# EAGLE design FourRandomLamps_RevB (EAGLE 9.5.0)
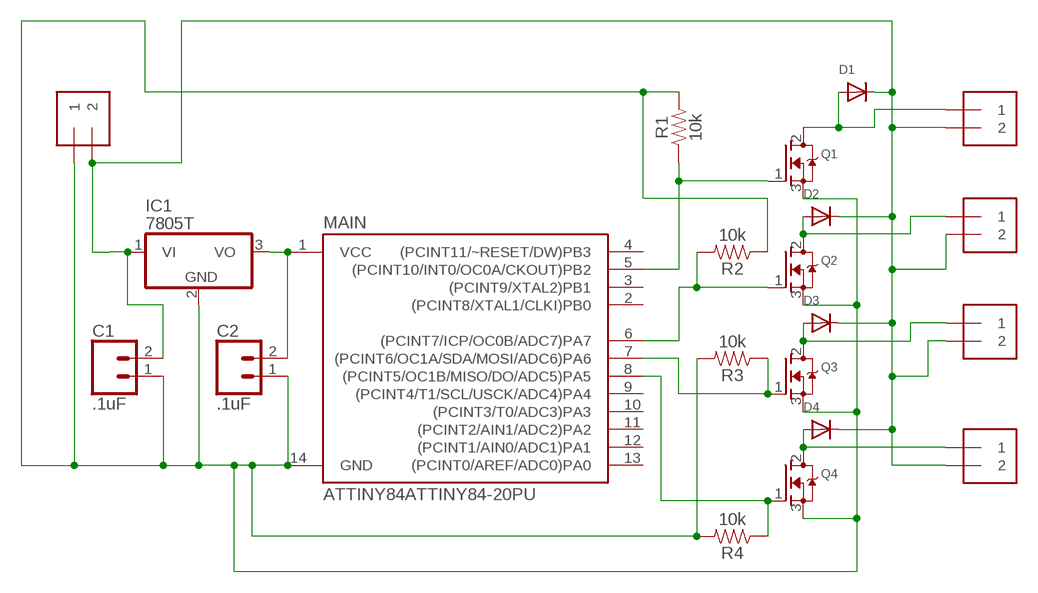
[diagram p0: schematic, sheet 1]

## Parts
12VDC  1X2-3.5MM  [1X2-3.5MM]
C1  .1uF  CONN_02LOCK  [1X02_LOCK]
C2  .1uF  CONN_02LOCK  [1X02_LOCK]
D1  DIODEDO-1N4148  [DO-1N4148]
D2  DIODEDO-1N4148  [DO-1N4148]
D3  DIODEDO-1N4148  [DO-1N4148]
D4  DIODEDO-1N4148  [DO-1N4148]
IC1  7805T  [TO220H]
LAMP1  1X2-3.5MM  [1X2-3.5MM]
LAMP2  1X2-3.5MM  [1X2-3.5MM]
LAMP3  1X2-3.5MM  [1X2-3.5MM]
LAMP4  1X2-3.5MM  [1X2-3.5MM]
MAIN  ATTINY84ATTINY84-20PU  [DIP14]
Q1  MOSFET-NGDS_TO220V  [TO220V]
Q2  MOSFET-NGDS_TO220V  [TO220V]
Q3  MOSFET-NGDS_TO220V  [TO220V]
Q4  MOSFET-NGDS_TO220V  [TO220V]
R1  10k  10KOHM-HORIZ-1/4W-5%  [AXIAL-0.3]
R2  10k  10KOHM-HORIZ-1/4W-5%  [AXIAL-0.3]
R3  10k  10KOHM-HORIZ-1/4W-5%  [AXIAL-0.3]
R4  10k  10KOHM-HORIZ-1/4W-5%  [AXIAL-0.3]

## Nets
N$1: C2.2 IC1.3(VO) MAIN.1(VCC)
N$2: 12VDC.2 C1.2 D1.C D2.C D3.C D4.C IC1.1(VI) LAMP1.2 LAMP2.2 LAMP3.2 LAMP4.2
N$3: MAIN.5((PCINT10/INT0/OC0A/CKOUT)PB2) Q1.1(G) R1.P$1
N$4: MAIN.6((PCINT7/ICP/OC0B/ADC7)PA7) Q2.1(G) R2.P$2
N$5: MAIN.7((PCINT6/OC1A/SDA/MOSI/ADC6)PA6) Q3.1(G) R3.P$1
N$6: MAIN.8((PCINT5/OC1B/MISO/DO/ADC5)PA5) Q4.1(G) R4.P$1
N$7: 12VDC.1 C1.1 C2.1 IC1.2(GND) MAIN.14(GND) Q1.3(S) Q2.3(S) Q3.3(S) Q4.3(S) R1.P$2 R2.P$1 R3.P$2 R4.P$2
N$9: D1.A LAMP1.1 Q1.2(D)
N$10: D2.A LAMP2.1 Q2.2(D)
N$11: D3.A LAMP3.1 Q3.2(D)
N$13: D4.A LAMP4.1 Q4.2(D)
Unconnected: MAIN.2((PCINT8/XTAL1/CLKI)PB0) MAIN.3((PCINT9/XTAL2)PB1) MAIN.4((PCINT11/~RESET/DW)PB3) MAIN.9((PCINT4/T1/SCL/USCK/ADC4)PA4) MAIN.10((PCINT3/T0/ADC3)PA3) MAIN.11((PCINT2/AIN1/ADC2)PA2) MAIN.12((PCINT1/AIN0/ADC1)PA1) MAIN.13((PCINT0/AREF/ADC0)PA0)

## Library data of the parts
12VDC LAMP1-LAMP4 = adafruit:1X2: 3.5mm Terminal block http://www.ladyada.net/library/pcb/eaglelibrary.html
C1 C2 = SparkFun-Connectors:CONN_02: Multi connection point. Often used as Generic Header-pin footprint for 0.1 inch spaced/style header connections On any of the 0.1 inch spaced packages, you can populate with these: Break Away Headers - Straight <https://www.sparkfun.com/products/116> (PRT-00116) Break Away Male Headers - Right Angle <https://www.sparkfun.com/products/553> (PRT-00553) Female Headers <https://www.sparkfun.com/products/115> (PRT-00115) Break Away Headers - Machine Pin <https://www.sparkfun.com/products/117> (PRT-00117) Break Away Female Headers - Swiss Machine Pin <https://www.sparkfun.com/products/743> (PRT-00743) For SCREWTERMINALS and SPRING TERMINALS visit here: Screw Terimnals on SparkFun.com <https://www.sparkfun.com/search/results?term=Screw+Terminals> (5mm/3.5mm/2.54mm spacing) This device is also useful as a general connection point to wire up your design to another part of your project. Our various solder wires solder well into these plated through hole pads. Hook-Up Wire - Assortment (Stranded, 22 AWG) <https://www.sparkfun.com/products/11375> (PRT-11375) Hook-Up Wire - Assortment (Solid Core, 22 AWG) <https://www.sparkfun.com/products/11367> (PRT-11367) View the entire wire category on our website here <https://www.sparkfun.com/categories/141> Special notes: Molex polarized connector foot print use with: PRT-08233 with associated crimp pins and housings. 2.54_SCREWTERM for use with PRT-10571. 3.5mm Screw Terminal footprints for PRT-08084 5mm Screw Terminal footprints for use with PRT-08432
D1-D4 = adafruit:DIODE: Diode SMADIODE - SMA Surface Mount Package 20V 1A Schottky Diode Digikey: 641-1014-6-ND DO-1N4148 - Through Hole Small Current Diode SOD-123 20V 1 A (.5mV Vf) Schottky Diode - Digikey: MBRX120TPMSCT-ND SOD-323 10V 570mA (.38mV Vf, 3ns) Schottky Diode - Digikey: ZLLS410CT-ND SOD-523 30V 30mA Schottky Diode (RB751S-40TE61) - Digikey: RB751S-40TE61CT-ND SOT23-R/W - SOT23 Package (R = Solder Paste/Reflow Ovens, W = Hand-Soldering) BAT54Film 40V 300mA - Digikey: 497-7162-1-ND
IC1 = adafruit:78*: Positive VOLTAGE REGULATOR Added bigger pads to the TO-92 package
MAIN = SparkFun-IC-Microcontroller:ATTINY84: Atmel 14-pin 2/4/8kB flash uC Datasheet <https://cdn.sparkfun.com/datasheets/Widgets/doc8006.pdf> SparkFun Products Tiny AVR Programmer <https://www.sparkfun.com/products/11801> (PGM-11801) SparkFun Servo Trigger - Continuous Rotation <https://www.sparkfun.com/products/13872> (WIG-13872) SparkFun Servo Trigger <https://www.sparkfun.com/products/13118> (WIG-13118)
Q1-Q4 = adafruit:MOSFET-N: N-Channel Mosfet 2N7002E - 60V 260mA SOT23 [Digikey: 2N7002ET1GOSTR-ND] - REEL BSH103 - 30V 850mA SOT23 [Digikey: 568-5013-1-ND]
R1-R4 = SparkFun-Resistors:10KOHM: 10kΩ resistor A resistor is a passive two-terminal electrical component that implements electrical resistance as a circuit element. Resistors act to reduce current flow, and, at the same time, act to lower voltage levels within circuits. - Wikipedia; PROD_ID: RES-09435

## Board
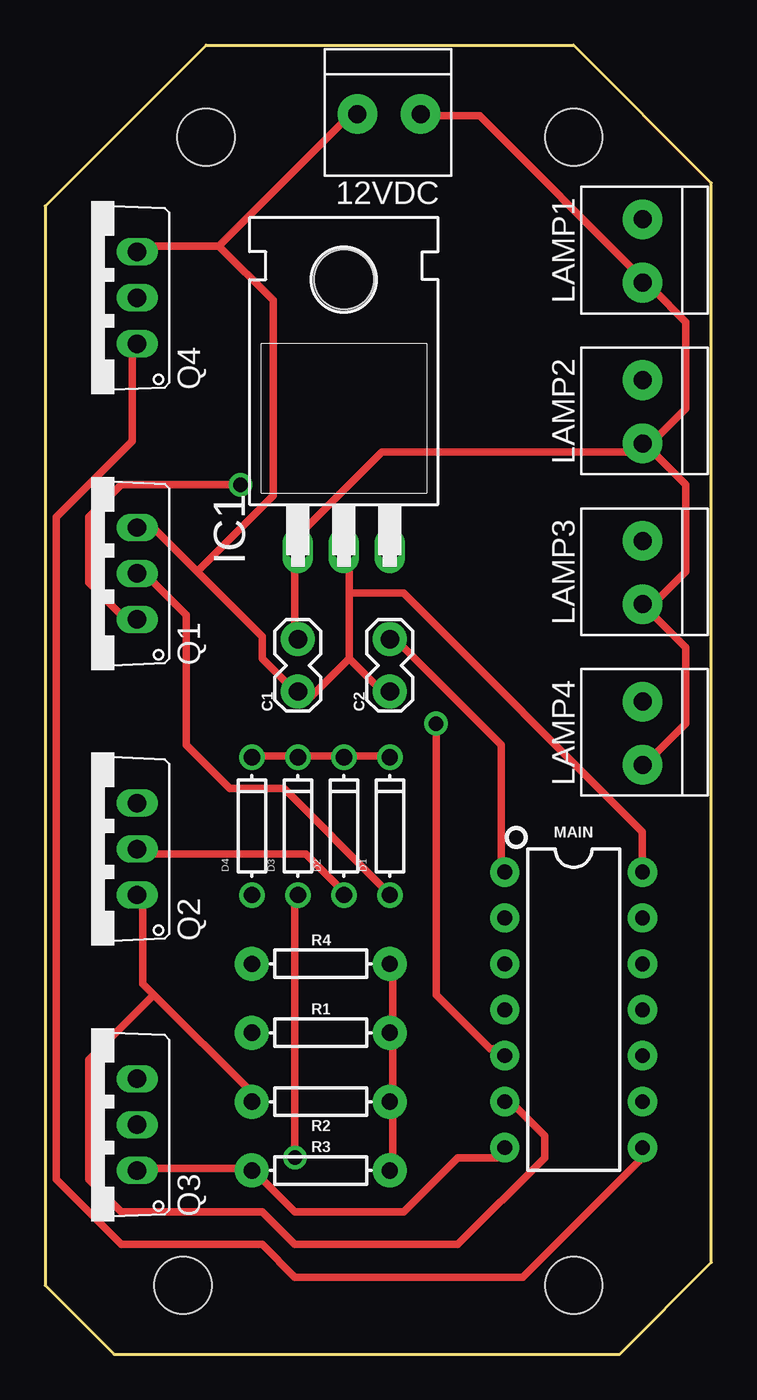
[diagram p1: board, top side]
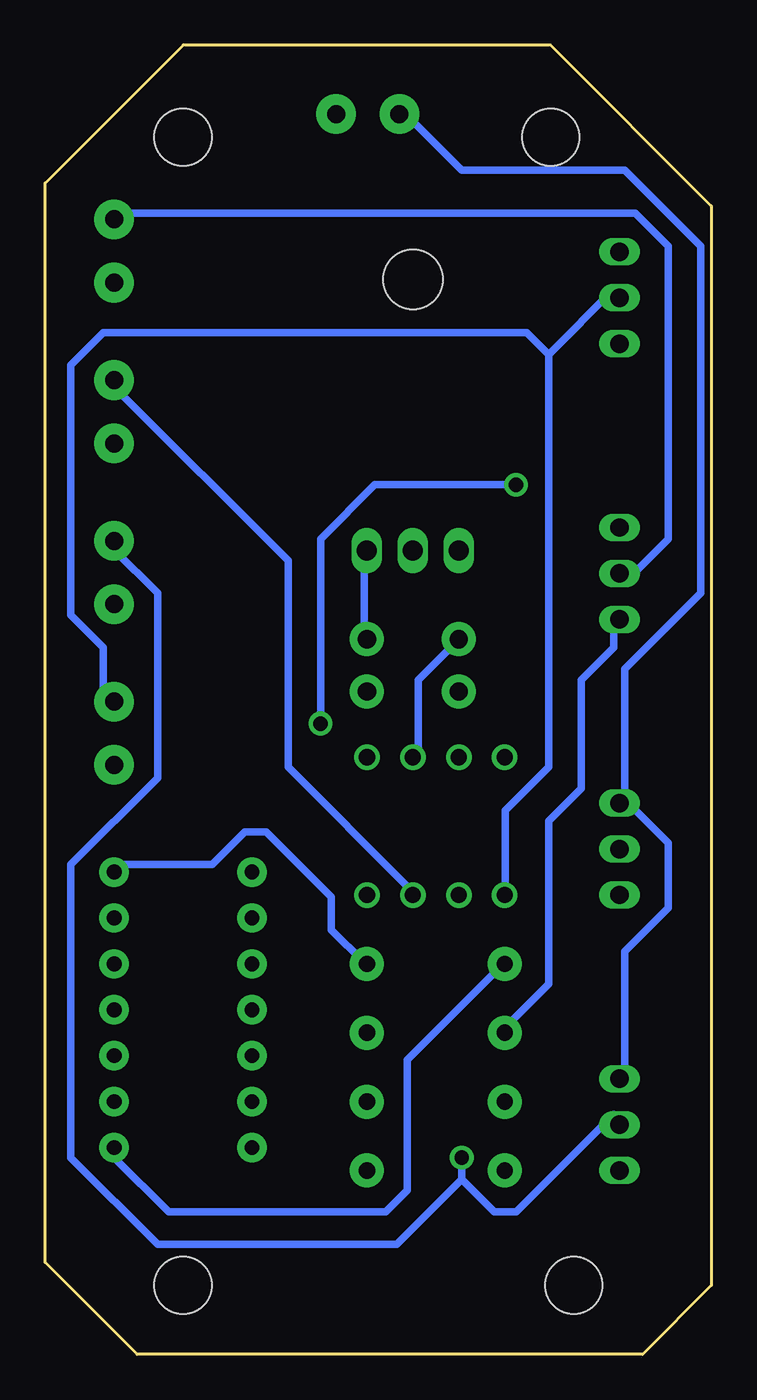
[diagram p2: board, bottom side, seen from below]

Size 36.83 x 72.39 mm. Coordinates in mm from the lower left corner, seen from the top.
Outline: 3.81,0 31.75,0 36.83,5.08 36.83,64.77 29.21,72.39 8.89,72.39 0,63.5 0,3.81 3.81,0
Copper layers (1*16): Top 0.035mm / dielectric 1.5mm / Bottom 0.035mm
Design rules "OthermillDRC_1_32_v2 *": minimum track width 16mil, minimum drill 0.8mm, track to track 0.794003125mm, track to pad 0.794003125mm, pad to pad 0.794003125mm, via to via 0.794003125mm, smd to smd 0mil, copper to edge 0mil, drill to drill 1mil, minimum pad ring 10mil, minimum via ring 10mil, stop-mask expansion 1mil, vias tented up to drill 30mil, thermal gap 10mil
Holes 3.17 mm at 8.89,67.31 7.62,3.81 29.21,3.81 29.21,67.31

### Footprints (pad centres in the part's own frame; a part is rotated, then mirrored left to right if it is on the bottom)
1X2-3.5MM = drill 1 pad 2.184: 1 1.8,0; 2 -1.7,0
1X02_LOCK = drill 1.016 pad 1.88: 1 -0.178,0; 2 2.718,0
DO-1N4148 = drill 0.9: A -3.81,0; C 3.81,0
TO220H = drill 1.118 long: 1 -2.54,-10.16; 2 0,-10.16; 3 2.54,-10.16 | hole 3.302: 0,4.826
DIP14 = drill 0.813 pad 1.626: 1 -7.62,-3.81; 2 -5.08,-3.81; 3 -2.54,-3.81; 4 0,-3.81; 5 2.54,-3.81; 6 5.08,-3.81; 7 7.62,-3.81; 8 7.62,3.81; 9 5.08,3.81; 10 2.54,3.81; 11 0,3.81; 12 -2.54,3.81; 13 -5.08,3.81; 14 -7.62,3.81
TO220V = drill 1.016 long: 1 -2.54,-2.54; 2 0,-2.54; 3 2.54,-2.54
AXIAL-0.3 = drill 0.9 pad 1.88: P$1 -3.81,0; P$2 3.81,0

### Placement (x,y rotation side)
12VDC  19.05,68.58 180 top
C1  13.97,36.83 90 top
C2  19.05,36.83 90 top
D1  19.05,29.21 90 top
D2  16.51,29.21 90 top
D3  13.97,29.21 90 top
D4  11.43,29.21 90 top
IC1  16.51,54.61 0 top
LAMP1  33.02,60.96 90 top
LAMP2  33.02,52.07 90 top
LAMP3  33.02,43.18 90 top
LAMP4  33.02,34.29 90 top
MAIN  29.21,19.05 270 top
Q1  2.54,43.18 90 top
Q2  2.54,27.94 90 top
Q3  2.54,12.7 90 top
Q4  2.54,58.42 90 top
R1  15.24,17.78 0 top
R2  15.24,13.97 180 top
R3  15.24,10.16 0 top
R4  15.24,21.59 0 top

### Tracks (layer width: path | path; a pad name or v marks a point on that pad's centre or on a via)
N$1
  Top 0.406: MAIN.1 25.21,27.08 25.21,33.68 19.21,39.68 C2.2
  Bottom 0.406: IC1.3 19.21,43.88 19.21,39.68 C2.2
N$2
  Top 0.406: C1.2 13.8,39.68 13.8,43.88 IC1.1 14.4,44.48 14.4,45.69 18.61,49.89 33.01,49.89 LAMP2.2 | D4.C 12,33.08 13.8,33.08 D3.C 14.4,33.08 16.2,33.08 D2.C 16.81,33.08 18.61,33.08 D1.C | LAMP4.2 33.61,33.08 35.41,34.88 35.41,39.08 33.61,40.88 LAMP3.2 33.61,41.48 35.41,43.28 35.41,48.09 33.61,49.89 LAMP2.2 | LAMP2.2 33.61,50.49 35.41,52.29 35.41,57.09 33.61,58.89 LAMP1.2 33.01,59.49 24.01,68.49 21.01,68.49 12VDC.2
  Bottom 0.406: C1.2 14.4,39.08 16.2,37.28 16.2,33.08 D2.C
N$3  (via drill 0.8)
  Top 0.406: v21.61,34.88 21.61,19.88 24.61,16.88 25.21,16.88 MAIN.5 | v10.8,48.09 4.2,48.09 2.4,46.29 2.4,42.68 4.8,40.28 Q1.1
  Bottom 0.406: Q1.1 5.4,40.28 5.4,39.08 7.2,37.28 7.2,31.28 9,29.48 9,20.48 11.4,18.08 R1.P$1 | v21.61,34.88 21.61,45.09 18.61,48.09 v10.8,48.09
N$4
  Top 0.406: 6,19.88 11.4,14.47 R2.P$2 | 6,19.88 5.4,20.48 5.4,25.28 Q2.1 | 6,19.88 2.4,16.28 2.4,9.67 4.2,7.87 12,7.87 13.8,6.07 22.81,6.07 27.61,10.87 27.61,12.07 25.81,13.87 MAIN.6
N$5
  Top 0.406: Q3.1 5.4,10.27 11.4,10.27 R3.P$1 12,9.67 13.8,7.87 19.81,7.87 22.81,10.87 25.21,10.87 MAIN.7
N$6
  Top 0.406: Q4.1 4.8,55.29 4.8,50.49 0.6,46.29 0.6,9.67 4.2,6.07 12,6.07 13.8,4.27 26.41,4.27 33.01,10.87 MAIN.8
  Bottom 0.406: R4.P$1 12,21.08 16.81,16.28 16.81,9.07 18.01,7.87 30.01,7.87 33.01,10.87 MAIN.8
N$7
  Top 0.406: R3.P$2 19.21,10.27 19.21,13.87 R2.P$1 19.21,14.47 19.21,17.47 R1.P$2 19.21,18.08 19.21,21.08 R4.P$2 | 16.81,38.48 16.81,42.08 | 16.81,42.08 16.81,43.88 IC1.2 | 16.81,38.48 18.61,36.68 C2.1 | 8.4,43.28 12,39.68 12,38.48 13.8,36.68 C1.1 14.4,36.08 16.81,38.48 | 8.4,43.28 6,45.69 5.4,45.69 Q1.3 | 9.6,61.29 5.4,61.29 Q4.3 | 9.6,61.29 16.81,68.49 12VDC.1 | 8.4,43.28 12.6,47.49 12.6,58.29 9.6,61.29 | 16.81,42.08 19.81,42.08 33.01,28.88 33.01,27.08 MAIN.14
  Bottom 0.406: MAIN.14 33.01,27.08 27.61,27.08 25.81,28.88 24.61,28.88 21.01,25.28 21.01,23.48 19.21,21.68 R4.P$2 | 4.8,30.68 2.4,28.28 2.4,24.68 4.8,22.28 4.8,15.67 Q3.3 | 4.8,30.68 4.8,37.88 0.6,42.08 0.6,61.29 4.8,65.49 13.8,65.49 16.81,68.49 12VDC.1 | 4.8,30.68 Q2.3
N$9
  Top 0.406: D1.A 18.61,25.88 13.2,31.28 10.2,31.28 7.8,33.68 7.8,40.88 5.4,43.28 Q1.2
  Bottom 0.406: LAMP1.1 33.01,63.09 4.2,63.09 2.4,61.29 2.4,45.09 4.8,42.68 Q1.2
N$10
  Top 0.406: D2.A 16.2,25.88 14.4,27.68 5.4,27.68 Q2.2
  Bottom 0.406: LAMP2.1 33.01,53.49 23.41,43.88 23.41,32.48 16.81,25.88 D2.A
N$11  (via drill 0.8)
  Top 0.406: v13.8,10.87 13.8,25.28 D3.A
  Bottom 0.406: 13.8,9.67 v13.8,10.87 | 13.8,9.67 12,7.87 10.8,7.87 5.4,13.27 Q3.2 | 13.8,9.67 17.41,6.07 30.61,6.07 35.41,10.87 35.41,27.08 30.61,31.88 30.61,42.08 33.01,44.48 LAMP3.1
N$13
  Bottom 0.406: 9,55.29 9,32.48 11.4,30.08 11.4,25.88 D4.A | 9,55.29 5.4,58.89 Q4.2 | 9,55.29 10.2,56.49 33.61,56.49 35.41,54.69 35.41,40.88 33.61,39.08 33.61,36.68 LAMP4.1